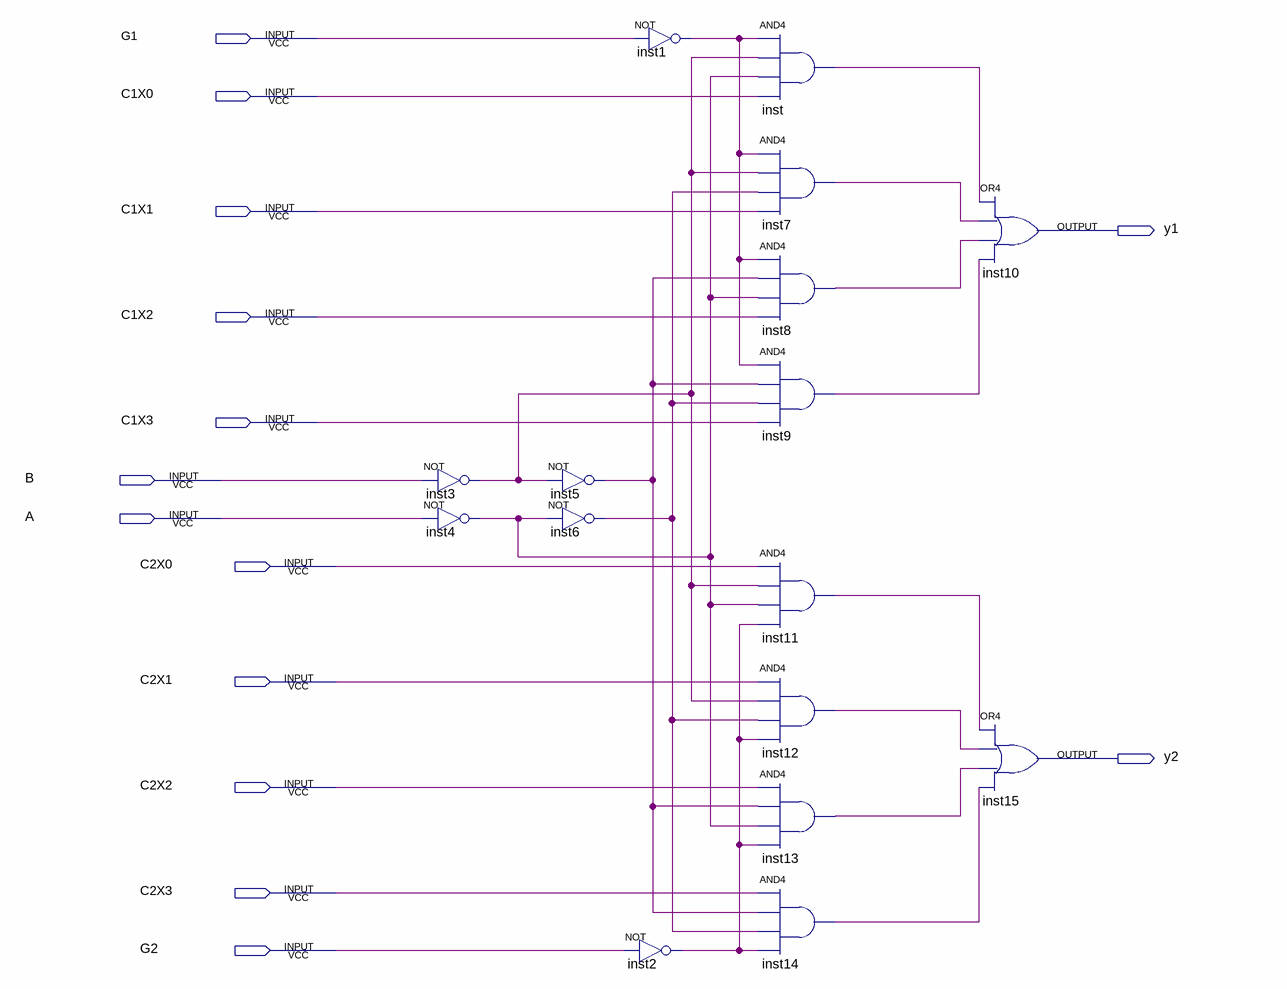
[diagram p0: schematic sheet]
// Quartus schematic CI74LS153.bdf as structural Verilog: 16 symbols, 14 pins
module CI74LS153 (
  input  G1,
  input  C1X0,
  input  C1X1,
  input  C1X2,
  input  C1X3,
  input  B,
  input  A,
  input  C2X0,
  input  C2X1,
  input  C2X2,
  input  C2X3,
  input  G2,
  output y1,
  output y2
);

  wire inst1_out, inst2_out, inst3_out, inst4_out, inst5_out, inst6_out, inst7_out, inst8_out, inst9_out,
       inst11_out, inst12_out, inst13_out, inst14_out, inst_out;

  not inst3 (inst3_out, B);
  not inst4 (inst4_out, A);
  not inst5 (inst5_out, inst3_out);
  not inst6 (inst6_out, inst4_out);
  not inst1 (inst1_out, G1);
  not inst2 (inst2_out, G2);
  and inst (inst_out, inst1_out, inst3_out, inst4_out, C1X0);
  and inst7 (inst7_out, inst1_out, inst3_out, inst6_out, C1X1);
  and inst8 (inst8_out, inst1_out, inst5_out, inst4_out, C1X2);
  and inst9 (inst9_out, inst1_out, inst5_out, inst6_out, C1X3);
  and inst11 (inst11_out, C2X0, inst3_out, inst4_out, inst2_out);
  and inst12 (inst12_out, C2X1, inst3_out, inst6_out, inst2_out);
  and inst13 (inst13_out, C2X2, inst5_out, inst4_out, inst2_out);
  and inst14 (inst14_out, C2X3, inst5_out, inst6_out, inst2_out);
  or inst10 (y1, inst_out, inst7_out, inst8_out, inst9_out);
  or inst15 (y2, inst11_out, inst12_out, inst13_out, inst14_out);
endmodule
